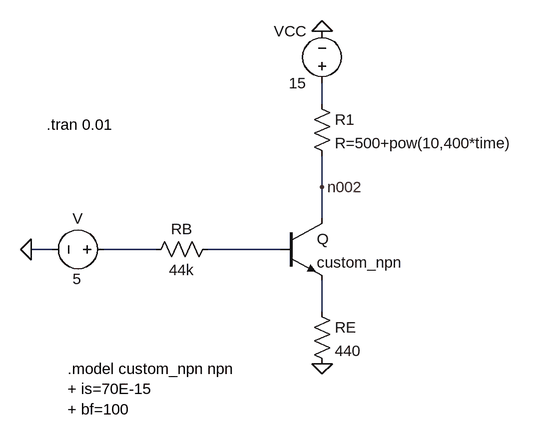
[diagram p0: schematic c02ex11s01.asc]
c02ex11s01.asc, the LTspice schematic file:
Version 4
SHEET 1 880 680
WIRE 256 144 256 112
WIRE 256 272 256 224
WIRE 256 320 256 272
WIRE -160 368 -192 368
WIRE 0 368 -80 368
WIRE 192 368 80 368
WIRE 256 464 256 416
FLAG 256 544 0
FLAG 256 32 0
FLAG -192 368 0
FLAG 256 272 n002
SYMBOL voltage -64 368 R90
WINDOW 0 -32 56 VBottom 2
WINDOW 3 61 57 VBottom 2
WINDOW 123 0 0 Left 0
WINDOW 39 0 0 Left 0
SYMATTR InstName V
SYMATTR Value 5
SYMBOL res -16 384 R270
WINDOW 0 32 56 VTop 2
WINDOW 3 0 56 VBottom 2
SYMATTR InstName RB
SYMATTR Value 44k
SYMBOL res 240 448 R0
SYMATTR InstName RE
SYMATTR Value 440
SYMBOL npn 192 320 R0
SYMATTR InstName Q
SYMATTR Value custom_npn
SYMBOL voltage 256 128 R180
WINDOW 0 24 96 Left 2
WINDOW 3 24 16 Left 2
WINDOW 123 0 0 Left 0
WINDOW 39 0 0 Left 0
SYMATTR InstName VCC
SYMATTR Value 15
SYMBOL res 240 128 R0
SYMATTR InstName R1
SYMATTR Value R=500+pow(10,400*time)
TEXT -168 176 Left 2 !.tran 0.01
TEXT -136 552 Left 2 !.model custom_npn npn\n+ is=70E-15\n+ bf=100

The netlist it stands for:
* c02ex11s01.asc
V N003 0 5
RB N003 N004 44k
RE N005 0 440
Q n002 N004 N005 0 custom_npn
VCC N001 0 15
R1 N001 n002 R=500+pow(10,400*time)
.model NPN NPN
.model PNP PNP
.lib standard.bjt
.tran 0.01
.model custom_npn npn
+ is=70E-15
+ bf=100
.backanno
.end